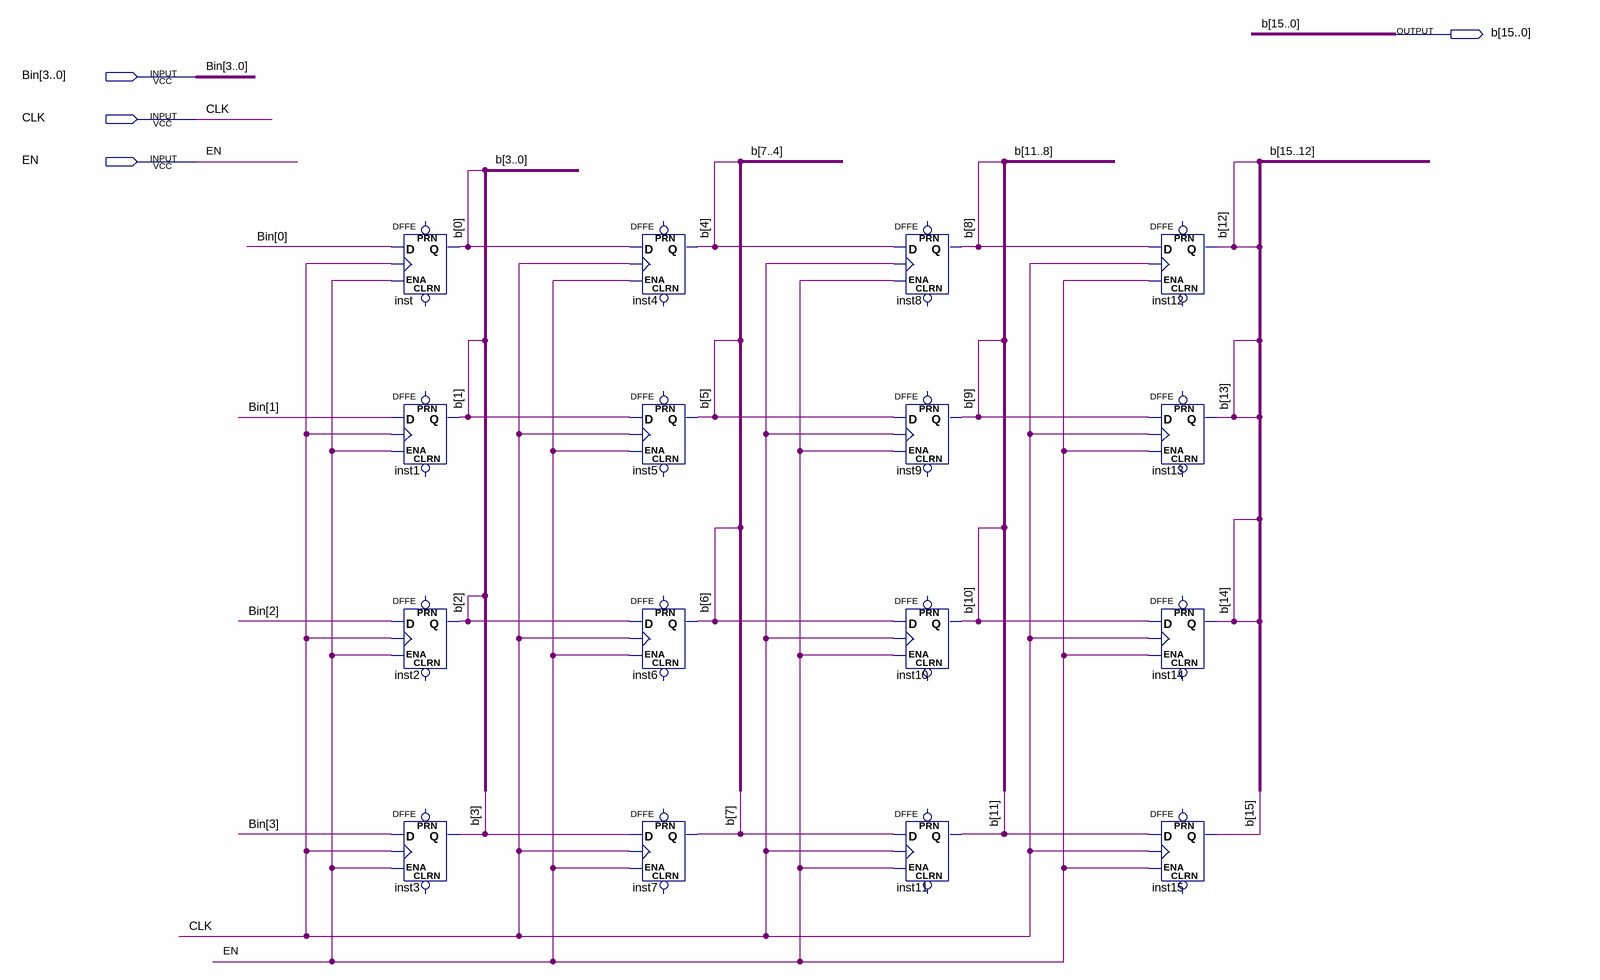
[diagram p0: schematic sheet]
// Quartus schematic bangoRegister.bdf as structural Verilog: 16 symbols, 4 pins
module bangoRegister (
  input  [3:0] Bin,
  input  CLK,
  input  EN,
  output [15:0] b
);

  DFFE inst (.D(Bin[0]), .CLK(CLK), .ENA(EN), .Q(b[0]));  // open: PRN, CLRN
  DFFE inst1 (.D(Bin[1]), .CLK(CLK), .ENA(EN), .Q(b[1]));  // open: PRN, CLRN
  DFFE inst2 (.D(Bin[2]), .CLK(CLK), .ENA(EN), .Q(b[2]));  // open: PRN, CLRN
  DFFE inst3 (.D(Bin[3]), .CLK(CLK), .ENA(EN), .Q(b[3]));  // open: PRN, CLRN
  DFFE inst4 (.D(b[0]), .CLK(CLK), .ENA(EN), .Q(b[4]));  // open: PRN, CLRN
  DFFE inst5 (.D(b[1]), .CLK(CLK), .ENA(EN), .Q(b[5]));  // open: PRN, CLRN
  DFFE inst6 (.D(b[2]), .CLK(CLK), .ENA(EN), .Q(b[6]));  // open: PRN, CLRN
  DFFE inst7 (.D(b[3]), .CLK(CLK), .ENA(EN), .Q(b[7]));  // open: PRN, CLRN
  DFFE inst8 (.D(b[4]), .CLK(CLK), .ENA(EN), .Q(b[8]));  // open: PRN, CLRN
  DFFE inst9 (.D(b[5]), .CLK(CLK), .ENA(EN), .Q(b[9]));  // open: PRN, CLRN
  DFFE inst10 (.D(b[6]), .CLK(CLK), .ENA(EN), .Q(b[10]));  // open: PRN, CLRN
  DFFE inst11 (.D(b[7]), .CLK(CLK), .ENA(EN), .Q(b[11]));  // open: PRN, CLRN
  DFFE inst12 (.D(b[8]), .CLK(CLK), .ENA(EN), .Q(b[12]));  // open: PRN, CLRN
  DFFE inst13 (.D(b[9]), .CLK(CLK), .ENA(EN), .Q(b[13]));  // open: PRN, CLRN
  DFFE inst14 (.D(b[10]), .CLK(CLK), .ENA(EN), .Q(b[14]));  // open: PRN, CLRN
  DFFE inst15 (.D(b[11]), .CLK(CLK), .ENA(EN), .Q(b[15]));  // open: PRN, CLRN
endmodule
